# EAGLE design KNOT_v1_0_disp (EAGLE 7.3.0)
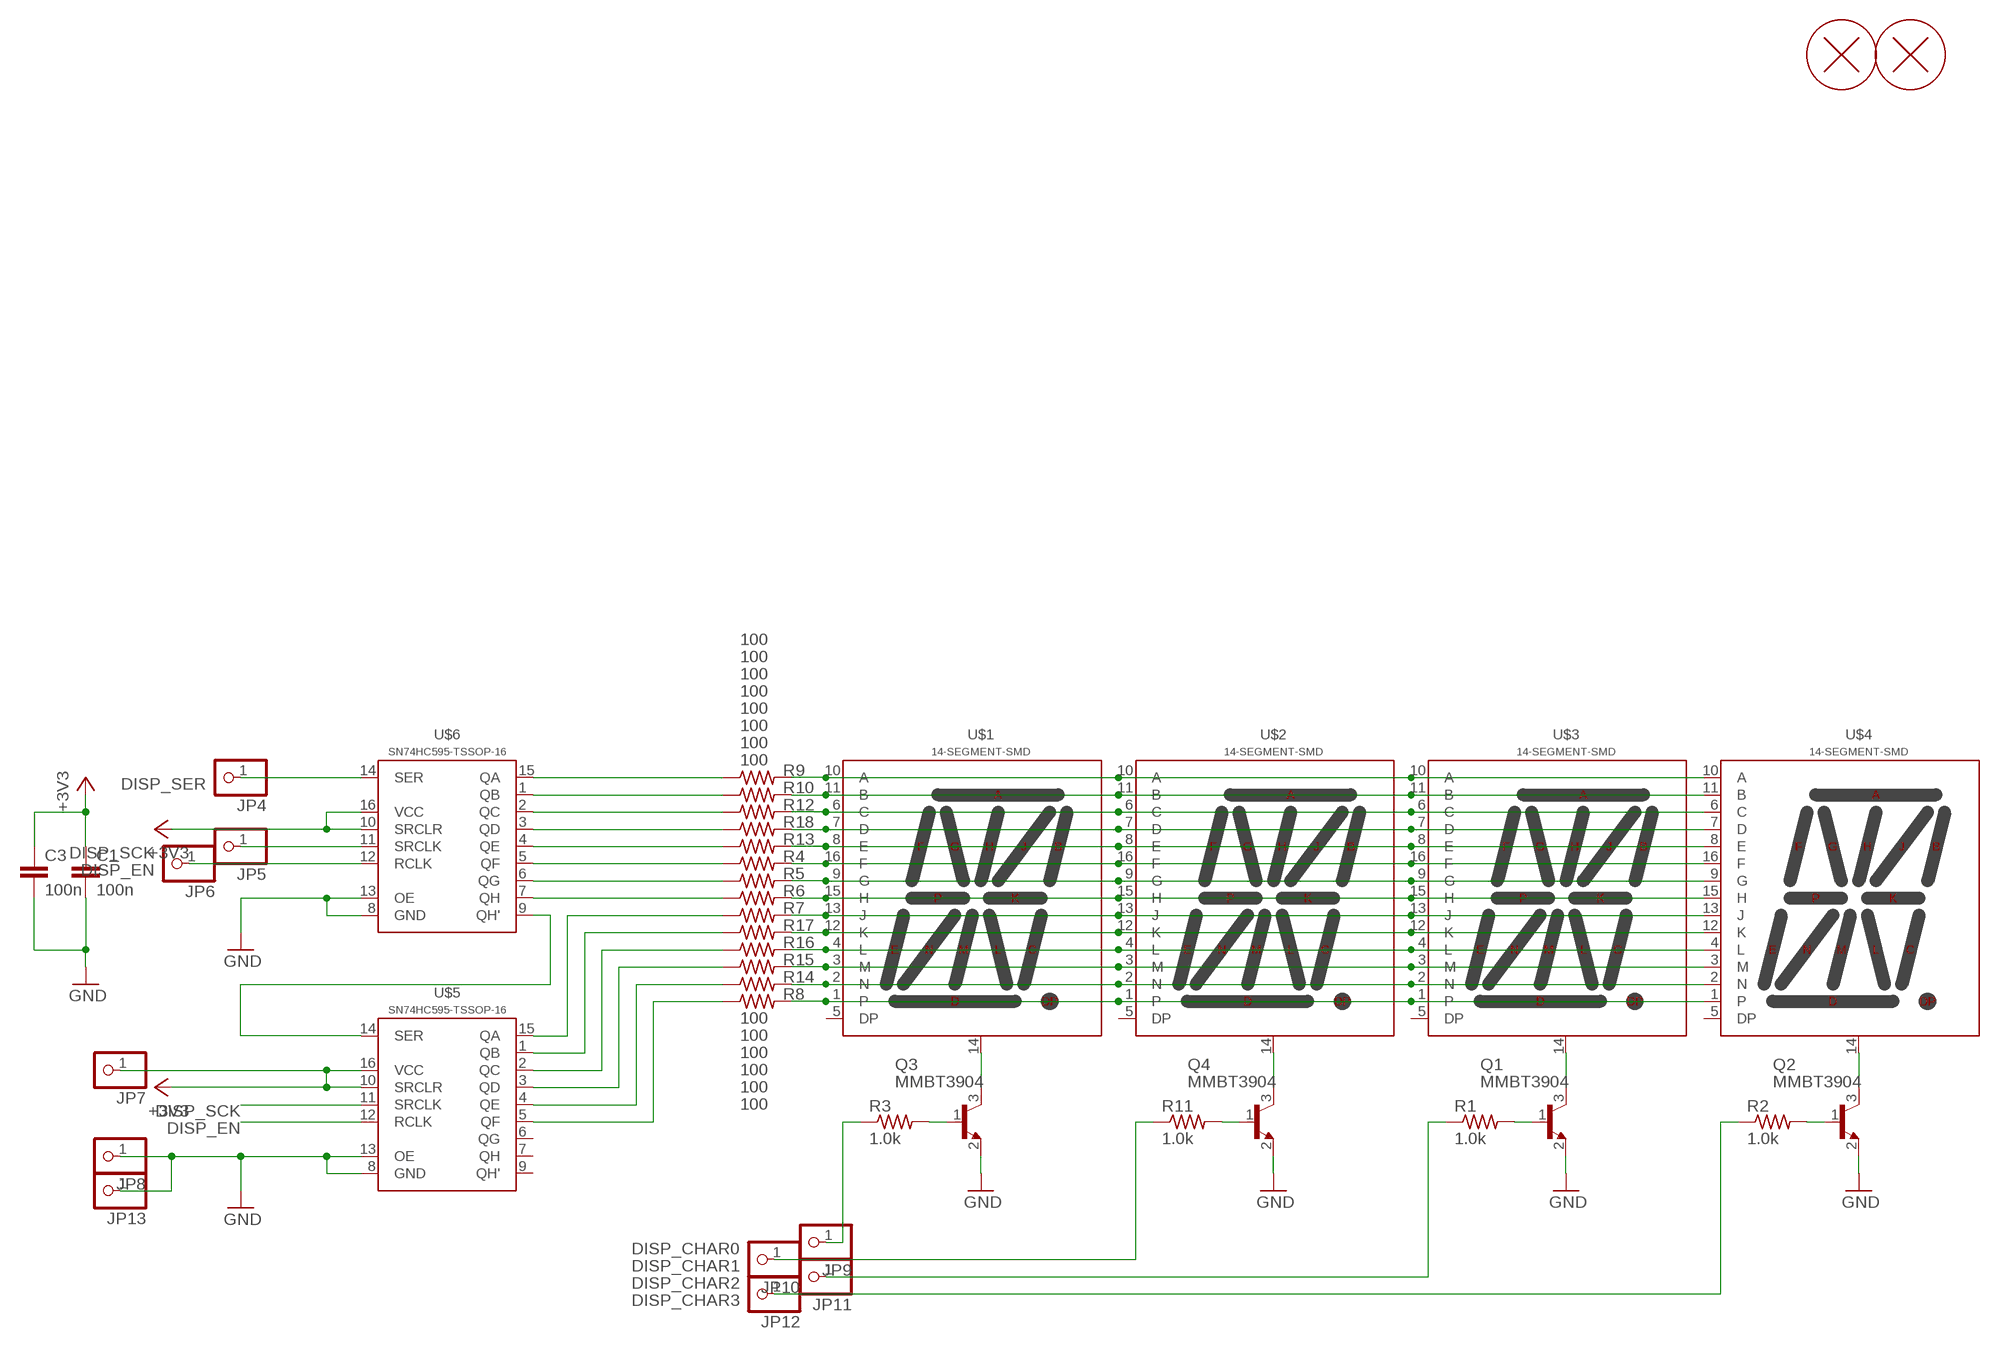
[diagram p0: schematic, sheet 1]

## Parts
C1  100n  CAPACITOR  [RESISTOR_0603]
C3  100n  CAPACITOR  [RESISTOR_0603]
H1  PCB_SCREW  [PCB_SCREW]
H2  PCB_SCREW  [PCB_SCREW]
JP4  PINHD-1X1  [1X01]
JP5  PINHD-1X1  [1X01]
JP6  PINHD-1X1  [1X01]
JP7  PINHD-1X1  [1X01]
JP8  PINHD-1X1  [1X01]
JP9  PINHD-1X1  [1X01]
JP10  PINHD-1X1  [1X01]
JP11  PINHD-1X1  [1X01]
JP12  PINHD-1X1  [1X01]
JP13  PINHD-1X1  [1X01]
Q1  MMBT3904  MMBT3904SOT23  [SOT23]
Q2  MMBT3904  MMBT3904SOT23  [SOT23]
Q3  MMBT3904  MMBT3904SOT23  [SOT23]
Q4  MMBT3904  MMBT3904SOT23  [SOT23]
R1  1.0k  RESISTOR  [RESISTOR_0603]
R2  1.0k  RESISTOR  [RESISTOR_0603]
R3  1.0k  RESISTOR  [RESISTOR_0603]
R4  100  RESISTOR  [RESISTOR_0603]
R5  100  RESISTOR  [RESISTOR_0603]
R6  100  RESISTOR  [RESISTOR_0603]
R7  100  RESISTOR  [RESISTOR_0603]
R8  100  RESISTOR  [RESISTOR_0603]
R9  100  RESISTOR  [RESISTOR_0603]
R10  100  RESISTOR  [RESISTOR_0603]
R11  1.0k  RESISTOR  [RESISTOR_0603]
R12  100  RESISTOR  [RESISTOR_0603]
R13  100  RESISTOR  [RESISTOR_0603]
R14  100  RESISTOR  [RESISTOR_0603]
R15  100  RESISTOR  [RESISTOR_0603]
R16  100  RESISTOR  [RESISTOR_0603]
R17  100  RESISTOR  [RESISTOR_0603]
R18  100  RESISTOR  [RESISTOR_0603]
U$1  14-SEGMENT-SMD  [14-SEGMENT-0.4"-SMD]
U$2  14-SEGMENT-SMD  [14-SEGMENT-0.4"-SMD]
U$3  14-SEGMENT-SMD  [14-SEGMENT-0.4"-SMD]
U$4  14-SEGMENT-SMD  [14-SEGMENT-0.4"-SMD]
U$5  SN74HC595-TSSOP-16  [TSSOP-16]
U$6  SN74HC595-TSSOP-16  [TSSOP-16]

## Nets
+3V3: C1.1 C3.1 JP7.1 U$5.10(SRCLR) U$5.16(VCC) U$6.10(SRCLR) U$6.16(VCC)
DISP_CHAR0: JP9.1 R3.1
DISP_CHAR1: JP10.1 R11.1
DISP_CHAR2: JP11.1 R1.1
DISP_CHAR3: JP12.1 R2.1
DISP_EN: JP6.1 U$5.12(RCLK) U$6.12(RCLK)
DISP_SCK: JP5.1 U$5.11(SRCLK) U$6.11(SRCLK)
DISP_SER: JP4.1 U$6.14(SER)
GND: C1.2 C3.2 JP8.1 JP13.1 Q1.2(E) Q2.2(E) Q3.2(E) Q4.2(E) U$5.8(GND) U$5.13(OE) U$6.8(GND) U$6.13(OE)
N$1: Q3.3(C) U$1.14(CATHODE)
N$2: Q4.3(C) U$2.14(CATHODE)
N$3: Q1.3(C) U$3.14(CATHODE)
N$4: Q2.3(C) U$4.14(CATHODE)
N$5: Q3.1(B) R3.2
N$6: Q4.1(B) R11.2
N$9: Q1.1(B) R1.2
N$10: Q2.1(B) R2.2
N$15: R9.2 U$1.10(A) U$2.10(A) U$3.10(A) U$4.10(A)
N$16: R10.2 U$1.11(B) U$2.11(B) U$3.11(B) U$4.11(B)
N$17: R12.2 U$1.6(C) U$2.6(C) U$3.6(C) U$4.6(C)
N$18: R18.2 U$1.7(D) U$2.7(D) U$3.7(D) U$4.7(D)
N$19: R13.2 U$1.8(E) U$2.8(E) U$3.8(E) U$4.8(E)
N$20: R4.2 U$1.16(F) U$2.16(F) U$3.16(F) U$4.16(F)
N$21: R5.2 U$1.9(G) U$2.9(G) U$3.9(G) U$4.9(G)
N$22: R6.2 U$1.15(H) U$2.15(H) U$3.15(H) U$4.15(H)
N$23: R7.2 U$1.13(J) U$2.13(J) U$3.13(J) U$4.13(J)
N$24: R17.2 U$1.12(K) U$2.12(K) U$3.12(K) U$4.12(K)
N$25: R16.2 U$1.4(L) U$2.4(L) U$3.4(L) U$4.4(L)
N$26: R15.2 U$1.3(M) U$2.3(M) U$3.3(M) U$4.3(M)
N$27: R14.2 U$1.2(N) U$2.2(N) U$3.2(N) U$4.2(N)
N$28: R8.2 U$1.1(P) U$2.1(P) U$3.1(P) U$4.1(P)
N$30: R6.1 U$6.7(QH)
N$31: U$5.14(SER) U$6.9(QH')
N$32: R9.1 U$6.15(QA)
N$33: R10.1 U$6.1(QB)
N$34: R12.1 U$6.2(QC)
N$35: R18.1 U$6.3(QD)
N$36: R13.1 U$6.4(QE)
N$37: R4.1 U$6.5(QF)
N$38: R5.1 U$6.6(QG)
N$39: R7.1 U$5.15(QA)
N$40: R17.1 U$5.1(QB)
N$41: R16.1 U$5.2(QC)
N$42: R15.1 U$5.3(QD)
N$43: R14.1 U$5.4(QE)
N$44: R8.1 U$5.5(QF)
Unconnected: U$1.5(DP) U$2.5(DP) U$3.5(DP) U$4.5(DP) U$5.6(QG) U$5.7(QH) U$5.9(QH')

## Library data of the parts
C1 C3 = parts_aman:CAPACITOR
H1 H2 = parts_aman:PCB_SCREW
JP4-JP13 = parts_aman:PINHD-1X1: PIN HEADER
Q1-Q4 = parts_aman:MMBT3904
R1-R18 = parts_aman:RESISTOR
U$1-U$4 = uBraids_SE:14-SEGMENT
U$5 U$6 = uBraids_SE:SN74HC595

## Board
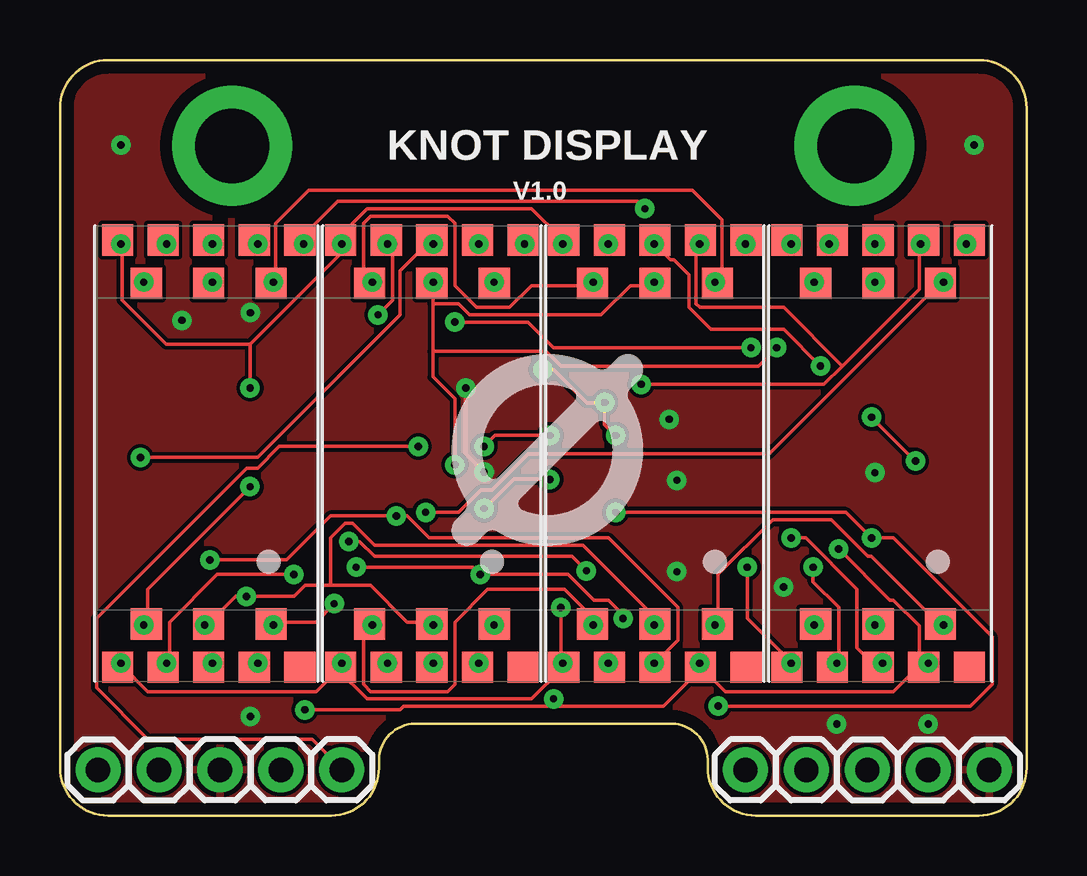
[diagram p1: board, top side]
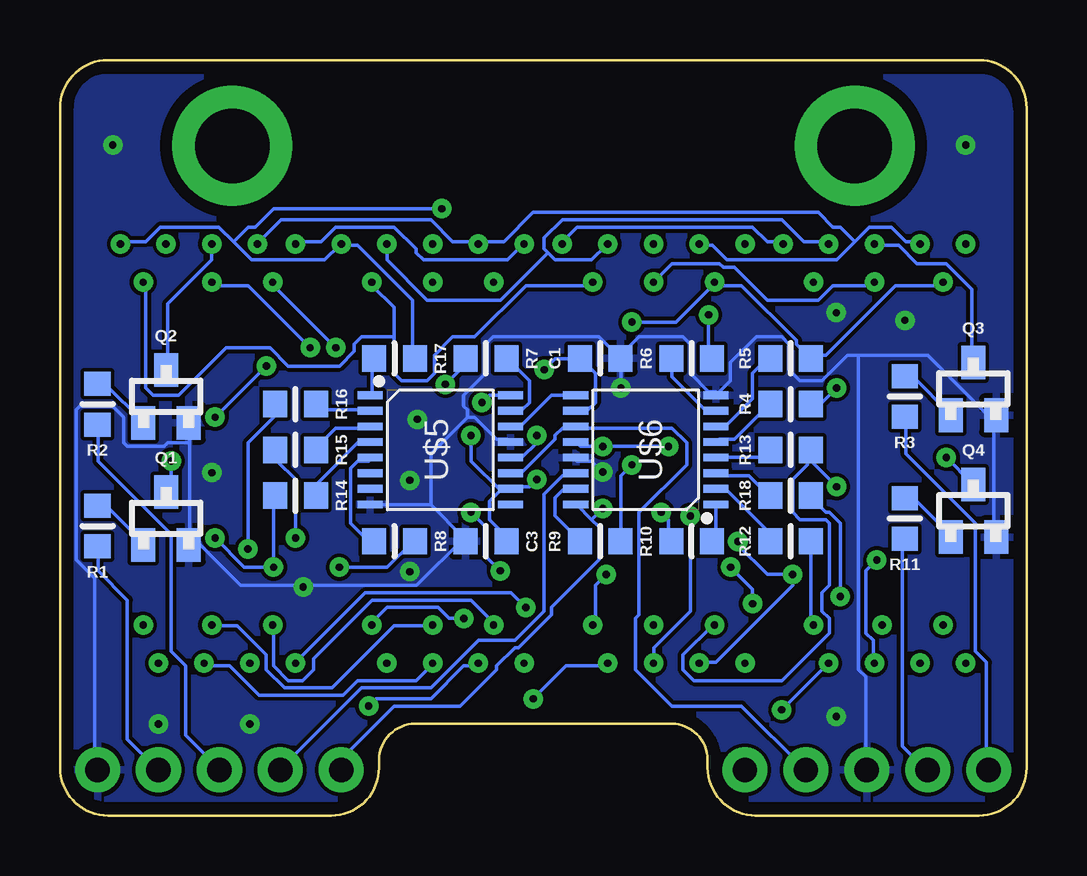
[diagram p2: board, bottom side, seen from below]

Size 40.3 x 31.48 mm. Coordinates in mm from the lower left corner, seen from the top.
Outline: 13.3,2 arc-90 11.3,0 2,0 arc-90 0,2 0,29.48 arc-90 2,31.48 38.3,31.48 arc-90 40.3,29.48 40.3,2 arc-90 38.3,0 29,0 arc-90 27,2
Outline: 13.3,2 13.3,2.33 arc-88 14.8,3.83 25.5,3.83 arc-88 27,2.33 27,2
Outline: 13.3,2 13.3,1.98
Outline: 27,2 27,1.98
Copper layers (1*16): Top 0.035mm / dielectric 1.5mm / Bottom 0.035mm
Design rules "PCBCart-Standard": minimum track width 6mil, minimum drill 12mil, track to track 6mil, track to pad 6mil, pad to pad 6mil, via to via 6mil, smd to smd 6mil, copper to edge 20mil, drill to drill 8mil, minimum pad ring 8mil, minimum via ring 10mil, stop-mask expansion 3mil, vias tented up to drill 25mil, thermal gap 8mil

### Footprints (pad centres in the part's own frame; a part is rotated, then mirrored left to right if it is on the bottom)
RESISTOR_0603 = smd 1 x 1.1: 1 -0.85,0; 2 0.85,0
PCB_SCREW = drill 3.1 pad 5: P$1 0,0
1X01 = drill 1.016 pad 1.88: 1 0,0
SOT23 = smd 1 x 1.4: 1 -0.95,-1.1; 2 0.95,-1.1; 3 0,1.1
14-SEGMENT-0.4"-SMD = smd 1.3 x 1.3: 1 -3.8,-8.9; 2 -1.9,-8.9; 3 0,-8.9; 4 1.9,-8.9; 5 3.8,-8.9; 6 2.6,-7.1; 7 0,-7.1; 8 -2.6,-7.1; 9 -2.6,7.1; 10 0,7.1; 11 2.6,7.1; 12 3.8,8.9; 13 1.9,8.9; 14 0,8.9; 15 -1.9,8.9; 16 -3.8,8.9
TSSOP-16 = smd 0.32 x 1.05: 1 -2.275,-2.925; 2 -1.625,-2.925; 3 -0.975,-2.925; 4 -0.325,-2.925; 5 0.325,-2.925; 6 0.975,-2.925; 7 1.625,-2.925; 8 2.275,-2.925; 9 2.275,2.925; 10 1.625,2.925; 11 0.975,2.925; 12 0.325,2.925; 13 -0.325,2.925; 14 -0.975,2.925; 15 -1.625,2.925; 16 -2.275,2.925

### Placement (x,y rotation side)
C1  17.78,19.05 0 bottom
C3  22.54,11.43 180 bottom
H1  33.12,27.9 0 top
H2  7.17,27.9 0 top
JP4  31.11,1.91 270 top
JP5  9.21,1.91 270 top
JP6  11.75,1.91 270 top
JP7  28.57,1.91 270 top
JP8  6.67,1.91 270 top
JP9  1.59,1.91 90 top
JP10  4.13,1.91 90 top
JP11  36.2,1.91 90 top
JP12  33.66,1.91 90 top
JP13  38.73,1.91 0 top
Q1  35.88,12.38 0 bottom
Q2  35.88,17.46 0 bottom
Q3  2.22,17.78 0 bottom
Q4  2.22,12.7 0 bottom
R1  38.73,12.06 90 bottom
R2  38.73,17.14 90 bottom
R3  5.08,17.46 90 bottom
R4  9.84,17.14 0 bottom
R5  9.84,19.05 0 bottom
R6  13.97,19.05 0 bottom
R7  22.54,19.05 180 bottom
R8  26.35,11.43 0 bottom
R9  17.78,11.43 0 bottom
R10  13.97,11.43 180 bottom
R11  5.08,12.38 90 bottom
R12  9.84,11.43 0 bottom
R13  9.84,15.24 0 bottom
R14  30.48,13.34 180 bottom
R15  30.48,15.24 180 bottom
R16  30.48,17.14 180 bottom
R17  26.35,19.05 0 bottom
R18  9.84,13.34 0 bottom
U$1  6.2,15.09 0 top
U$2  15.5,15.09 0 top
U$3  24.8,15.09 0 top
U$4  34.1,15.09 0 top
U$5  24.45,15.24 270 bottom
U$6  15.88,15.24 90 bottom
U$7  [LOGO_8]  20.32,15.24 0 top

### Tracks (layer width: path | path; a pad name or v marks a point on that pad's centre or on a via)
+3V3  (via drill 0.3)
  Top 0.152: v23.16,15.84 22.71,16.29 v22.71,17.21 21.95,17.21 20.57,18.58 v20.12,18.58 | v20.42,14.01 18.9,14.01 v17.68,12.79
  Bottom 0.152: U$6.10 18.75,16.9 18.29,16.9 17.98,17.21 17.98,18.43 18.59,19.04 C1.1 18.75,19.04 19.66,19.04 v20.12,18.58 | 21.95,13.55 21.64,13.55 U$5.10 | 21.95,13.55 22.4,13.09 22.4,12.33 21.64,11.57 C3.1 | v22.71,17.21 22.4,17.51 21.64,17.51 U$5.16 | v23.16,15.84 23.16,14.77 21.95,13.55 | 21.95,13.55 U$5.10 | 18.14,12.33 17.83,12.03 17.83,10.66 19.81,8.67 19.81,8.37 21.18,7 21.34,7 22.1,6.24 22.1,6.08 23.62,4.56 26.36,4.56 28.5,2.43 28.5,1.97 JP7.1 | 18.14,12.33 18.75,12.94 U$6.16 | v20.42,14.01 20.73,13.7 21.49,13.7 U$5.10 | 18.14,12.33 v17.68,12.79
DISP_CHAR0
  Bottom 0.152: R3.1 5.03,16.6 5.03,15.07 2.13,12.18 2.13,6.85 1.68,6.39 1.68,1.97 JP9.1
DISP_CHAR1
  Bottom 0.152: R11.1 5.18,11.42 5.18,2.88 4.27,1.97 JP10.1
DISP_CHAR2
  Bottom 0.152: R1.1 38.71,11.11 38.71,10.2 37.49,8.98 37.49,3.19 36.27,1.97 JP11.1
DISP_CHAR3
  Bottom 0.152: R2.1 38.71,16.29 38.71,14.77 35.66,11.72 35.66,6.85 35.05,6.24 35.05,3.34 33.68,1.97 JP12.1
DISP_EN  (via drill 0.3)
  Top 0.152: v20.42,15.84 18.14,15.84 v17.68,15.38 | v14.94,15.38 9.14,15.38 8.23,14.47 7.77,14.47 1.52,8.22 1.52,5.32 3.66,3.19 10.52,3.19 11.73,1.97 JP6.1
  Bottom 0.152: v20.42,15.84 20.42,15.53 21.03,14.92 21.49,14.92 U$5.12 | U$6.12 18.75,15.53 18.59,15.38 v17.68,15.38 v14.94,15.38
DISP_SCK
  Bottom 0.152: U$5.11 21.49,14.31 21.03,14.31 19.66,15.68 19.66,15.84 19.36,16.14 18.9,16.14 U$6.11 18.75,16.14 14.78,16.14 14.17,15.53 14.17,14.62 16.15,12.64 16.15,8.37 16.31,8.22 16.31,6.08 14.78,4.56 11.89,4.56 9.3,1.97 JP5.1
DISP_SER
  Bottom 0.152: U$6.14 18.9,14.16 19.36,14.16 20.12,13.4 20.12,8.52 21.34,7.3 22.86,7.3 24.84,5.32 27.74,5.32 31.09,1.97 JP4.1
GND  (via drill 0.3)
  Top 0.152: v17.68,14.31 16.92,15.07 v16.92,17.82
  Bottom 0.152: 34.9,15.53 34.9,16.29 Q2.2 | 34.9,15.53 34.9,11.42 Q1.2 34.9,11.26 34.44,11.26 32.77,9.59 25.43,9.59 23.46,11.56 | 24.84,12.94 27.28,12.94 U$5.8 | 23.47,11.57 23.46,11.56 | 23.47,11.57 24.84,12.94 | 23.47,11.57 C3.2 23.46,11.56 | 23.32,16.6 23.01,16.6 22.1,15.68 21.64,15.68 U$5.13 | 23.32,16.6 24.84,15.07 24.84,12.94 | 34.9,15.53 35.81,15.53 35.97,15.38 37.49,15.38 37.64,15.53 37.64,16.6 38.1,17.06 39.47,17.06 39.62,16.9 39.62,10.66 38.86,9.89 38.86,1.97 JP13.1 | Q4.2 1.37,11.72 1.37,16.6 Q3.2 1.37,16.75 1.68,16.75 4.12,19.19 7.01,19.19 | C1.2 16.92,19.19 16.15,19.95 14.33,19.95 14.02,19.65 14.02,18.43 13.26,17.67 12.95,17.67 U$6.8 12.8,17.67 12.34,18.12 12.34,18.88 11.28,19.95 10.21,19.95 9.91,19.65 9.91,18.58 9.45,18.12 8.53,18.12 7.47,19.19 7.01,19.19 | v17.68,14.31 18.14,14.77 18.75,14.77 U$6.13 | v16.92,17.82 16.92,19.04 C1.2 | 7.01,19.19 7.01,6.08 6.71,5.78 6.71,1.97 JP8.1 | 23.32,16.6 23.32,16.9 23.47,17.06 23.47,17.51 22.55,18.43 22.55,19.65 22.25,19.95 17.83,19.95 17.07,19.19 C1.2
  other vias: 2.54,27.94 38.1,27.94 25.4,16.51 25.72,13.97 30.16,9.53 33.97,14.29 5.08,20.64 7.94,4.13 32.38,3.81 36.2,3.81 25.72,10.16 7.94,20.95
  pour Bottom: -0.32,-0.32 40.34,-0.32 arc90 40.64,-0.01 40.64,31.43 40.64,31.75 -0.01,31.75 arc90 -0.32,31.45
  pour Top: 0,-0.32 40.34,-0.32 arc90 40.64,-0.01 40.64,31.75 -0.01,31.75 arc90 -0.32,31.45 -0.32,-0.32
N$1  (via drill 0.3)
  Top 0.152: U$1.14 6.2,23.96 v6.35,23.81
  Bottom 0.152: v6.35,23.81 6.25,23.76 5.33,23.76 4.57,23 3.35,23 2.29,21.93 2.29,18.88 Q3.3
N$2  (via drill 0.3)
  Top 0.152: v15.56,23.81 15.38,23.99 U$2.14 15.39,23.91 14.17,22.69 14.17,20.87 8.23,14.92 v3.35,14.92
  Bottom 0.152: v3.35,14.92 2.29,13.86 Q4.3
N$3  (via drill 0.3)
  Top 0.152: v24.77,23.81 24.91,23.67 U$3.14 24.84,23.76 25.45,23.15 25.6,23.15 26.21,22.54 26.21,21.17 27.13,20.26 30.18,20.26 v31.7,18.73 | v35.66,14.77 v33.83,16.6
  Bottom 0.152: v33.83,16.6 v31.7,18.73 | v35.66,14.77 35.66,13.7 35.81,13.55 Q1.3
N$4  (via drill 0.3)
  Top 0.152: U$4.14 34.1,23.94 v33.97,23.81
  Bottom 0.152: v33.97,23.81 33.98,23.76 33.98,23.15 35.81,21.32 35.81,18.58 Q2.3
N$5
  Bottom 0.152: R3.2 5.03,18.28 4.72,18.28 3.2,16.75 Q3.1
N$6
  Bottom 0.152: R11.2 5.03,13.09 4.57,13.09 3.2,11.72 Q4.1
N$9
  Bottom 0.152: R1.2 38.71,12.79 38.25,12.79 36.88,11.42 Q1.1
N$10
  Bottom 0.152: R2.2 38.71,17.97 38.41,17.97 36.88,16.45 Q2.1
N$15  (via drill 0.3)
  Top 0.152: v15.56,22.23 15.5,21.96 U$2.10 15.54,21.93 15.54,21.32 | U$1.10 6.2,22.05 v6.35,22.23 | v24.77,22.23 U$3.10 24.69,22.09 23.77,22.09 22.55,20.87 17.07,20.87 16.61,21.32 15.54,21.32 | U$4.10 34.1,22.04 v33.97,22.23 | v16.46,14.62 16.46,17.36 15.54,18.28 15.54,19.34 | 15.54,21.32 15.54,19.34 | v29.87,19.49 29.11,18.73 20.88,18.73 20.27,19.34 15.54,19.34
  Bottom 0.152: v16.46,14.62 16.92,14.16 16.92,11.57 R9.2 | v15.56,22.23 14.78,23 12.8,23 12.65,22.85 12.19,22.85 10.82,21.48 8.69,21.48 8.08,22.09 6.4,22.09 v6.35,22.23 | v29.87,19.49 32.46,22.09 33.83,22.09 v33.97,22.23
N$16  (via drill 0.3)
  Top 0.152: v8.89,22.23 8.8,22.14 U$1.11 8.99,22.24 8.99,24.68 10.36,26.05 26.36,26.05 27.58,24.83 27.58,22.54 U$3.11 | U$3.11 27.4,22.13 v27.3,22.23 | v36.83,22.23 36.7,22.42 U$4.11 36.58,22.09 29.57,15.07 19.51,15.07 17.98,13.55 17.53,13.55 16.61,12.64 v15.24,12.64 | U$3.11 27.4,22.32 27.62,22.54 | U$2.11 18.1,21.91 v18.1,22.23
  Bottom 0.152: 26.36,19.95 26.36,21.17 27.28,22.09 v27.3,22.23 | 26.36,19.95 26.36,18.43 26.06,18.12 24.99,18.12 24.69,18.43 24.69,19.19 23.93,19.95 23.01,19.95 20.88,22.09 18.14,22.09 v18.1,22.23 | v15.24,12.64 14.94,12.33 14.94,11.57 R10.2 | 26.36,19.95 27.74,19.95 28.04,19.65 28.04,19.34 28.65,18.73 30.79,18.73 31.55,19.49 33.38,19.49 35.36,17.51 36.42,17.51 36.73,17.82 36.73,22.09 v36.83,22.23
N$17  (via drill 0.3)
  Top 0.152: v8.89,7.94 8.62,7.99 U$1.6 8.99,8.06 10.67,8.06 v11.43,8.83 | U$2.6 18.1,8.25 v18.1,7.94 | v36.83,7.94 36.7,7.81 U$4.6 36.58,8.06 33.83,10.81 33.68,10.81 32.16,12.33 29.72,12.33 27.43,10.05 27.43,8.06 U$3.6 27.09,7.72 v27.3,7.94 | v23.47,8.22 23.47,8.37 22.86,8.98 22.25,8.98 21.18,10.05 v17.53,10.05 17.22,10.35 v12.34,10.35
  Bottom 0.152: R12.2 8.99,11.42 8.99,8.06 v8.89,7.94 | v17.53,10.05 17.98,9.59 17.98,8.06 v18.1,7.94 | v23.47,8.22 24.08,8.22 24.54,8.67 26.67,8.67 27.28,8.06 v27.3,7.94 | v11.43,8.83 11.43,9.44 v12.34,10.35
N$18  (via drill 0.3)
  Top 0.152: v6.03,7.94 6.2,8.11 U$1.7 6.25,8.06 7.32,9.13 v7.77,9.13 9.75,9.13 10.21,9.59 11.28,9.59 | v15.56,7.94 15.5,8.2 U$2.7 15.39,8.06 14.48,8.06 12.95,9.59 11.28,9.59 | U$4.7 34.1,8.12 v33.97,7.94 | v24.77,7.94 24.8,8.22 U$3.7 24.84,8.22 21.79,11.26 13.11,11.26 12.19,12.18 11.89,12.18 11.28,11.57 11.28,9.59
  Bottom 0.152: v24.77,7.94 24.84,7.91 26.36,7.91 28.96,5.32 30.94,5.32 31.7,6.08 31.7,6.69 32.92,7.91 33.83,7.91 v33.97,7.94 | v7.77,9.13 7.77,12.18 8.23,12.64 8.38,12.64 8.99,13.25 R18.2
N$19  (via drill 0.3)
  Top 0.152: v3.49,7.94 3.29,7.73 U$1.8 3.66,8.06 3.66,9.44 v7.92,13.7 | v13.02,7.94 12.97,7.99 U$2.8 12.8,7.91 12.65,7.76 12.65,5.47 12.95,5.17 16.15,5.17 16.46,5.47 16.46,8.06 17.83,9.44 21.03,9.44 22.1,8.37 22.1,8.06 U$3.8 22.27,7.99 v22.23,7.94 | U$4.8 31.5,8.18 v31.43,7.94
  Bottom 0.152: v22.23,7.94 22.25,8.06 23.16,8.98 27.28,8.98 29.72,6.54 29.72,6.08 30.18,5.63 30.79,5.63 31.39,6.24 31.39,7.91 v31.43,7.94 | 9.14,14.92 9.14,14.62 9.75,14.01 9.75,12.64 9.45,12.33 8.38,12.33 8.23,12.18 8.23,9.59 8.53,9.28 8.53,8.52 8.23,8.22 8.23,7.61 10.21,5.63 13.87,5.63 14.33,6.08 14.33,6.69 13.11,7.91 v13.02,7.94 | 9.14,14.92 9.14,15.23 R13.2 9.14,14.92 | 9.14,14.92 v7.92,13.7
N$20  (via drill 0.3)
  Top 0.152: v2.54,23.81 2.71,23.99 U$1.16 2.59,23.76 2.59,21.48 4.42,19.65 7.92,19.65 | U$2.16 11.7,23.86 v11.75,23.81 | U$2.16 11.92,23.99 12.06,24.13 | v20.95,23.81 21.1,23.99 U$3.16 20.88,24.07 19.66,25.29 12.8,25.29 12.04,24.52 12.04,24.07 U$2.16 | U$4.16 30.34,23.67 v30.48,23.81 | 7.92,19.65 v7.92,17.82 | 7.92,19.65 11.73,23.46 11.73,23.76 U$2.16
  Bottom 0.152: v7.92,17.82 8.53,17.21 8.99,17.21 R4.2 | v30.48,23.81 30.48,23.91 29.41,23.91 28.8,24.52 26.36,24.52 25.45,23.61 25.45,23.46 25.15,23.15 21.64,23.15 21.03,23.76 v20.95,23.81
N$21  (via drill 0.3)
  Top 0.152: U$1.9 3.6,22.43 v3.49,22.23 | U$2.9 12.9,22.02 13.02,21.91 | v22.23,22.23 22.2,21.93 U$3.9 22.1,22.09 19.66,22.09 18.75,21.17 17.37,21.17 16.46,22.09 16.46,24.68 16.15,24.98 12.95,24.98 12.65,24.68 12.65,22.39 12.8,22.24 U$2.9 | U$2.9 12.98,22.19 v13.02,22.23 | U$4.9 31.39,22.19 v31.43,22.23 | v28.8,19.49 20.57,19.49 19.51,20.56 v16.46,20.56
  Bottom 0.152: v3.49,22.23 3.5,22.09 5.49,22.09 8.38,19.19 8.99,19.19 R5.2 9.14,19.19 9.6,19.65 9.6,19.8 11.89,22.09 12.95,22.09 v13.02,22.23 13.11,22.09 14.63,20.56 v16.46,20.56 | v28.8,19.49 31.39,22.09 v31.43,22.23
N$22  (via drill 0.3)
  Top 0.152: v13.65,23.81 13.6,24.08 U$2.15 13.72,23.76 13.87,23.61 13.87,21.48 v13.26,20.87 | U$4.15 32.2,23.63 v32.07,23.81 | U$3.15 22.69,23.99 v22.86,23.81 | U$1.15 4.3,23.95 v4.45,23.81 U$1.15
  Bottom 0.152: 22.86,23.91 23.93,23.91 24.84,24.83 31.09,24.83 32,23.91 v32.07,23.81 | v13.26,20.87 13.26,19.19 R6.2 | 7.16,23.91 7.92,23.15 12.5,23.15 13.11,23.76 13.56,23.76 v13.65,23.81 | 7.16,23.91 6.55,24.52 5.64,24.52 5.03,23.91 4.57,23.91 v4.45,23.81 | 22.86,23.91 21.79,23.91 20.57,25.13 8.69,25.13 8.08,24.52 7.77,24.52 7.16,23.91 | 22.86,23.91 v22.86,23.81
N$23  (via drill 0.3)
  Top 0.152: U$1.13 8.1,23.96 v8.26,23.81 | v26.67,23.81 26.81,23.99 U$3.13 26.67,23.76 26.52,23.61 26.52,21.32 26.67,21.17 30.18,21.17 32.61,18.73 | v35.88,23.81 36.05,23.99 U$4.13 35.81,23.76 35.81,21.93 32.61,18.73 | U$2.13 17.4,24.07 v17.46,23.81 | v24.23,17.97 31.85,17.97 32.61,18.73
  Bottom 0.152: v24.23,17.97 23.47,18.73 23.47,19.04 R7.2 | 19.96,23.46 19.66,23.15 18.14,23.15 17.53,23.76 v17.46,23.81 | 19.96,23.46 20.12,23.61 20.12,24.07 19.36,24.83 10.21,24.83 9.3,23.91 8.38,23.91 v8.26,23.81 | v26.67,23.81 26.67,23.15 24.99,21.48 21.95,21.48 19.96,23.46
N$24  (via drill 0.3)
  Top 0.152: v10.16,23.81 10.02,23.99 U$1.12 10.06,24.07 11.58,25.59 24.08,25.59 v24.38,25.29 | U$2.12 19.3,23.88 v19.37,23.81 | U$4.12 37.96,23.99 v37.78,23.81 | U$3.12 28.6,23.84 v28.57,23.81
  Bottom 0.152: v10.16,23.81 10.21,23.91 10.82,23.91 11.43,24.52 18.75,24.52 19.36,23.91 v19.37,23.81 | R17.2 25.6,19.19 25.6,21.48 27.89,23.76 28.5,23.76 v28.57,23.81 28.65,23.76 29.26,23.15 32.31,23.15 33.07,23.91 | 33.07,23.91 33.68,24.52 36.12,24.52 36.73,23.91 37.64,23.91 v37.78,23.81 | v24.38,25.29 31.39,25.29 32.16,24.52 32.46,24.52 33.07,23.91
N$25  (via drill 0.3)
  Top 0.152: U$1.4 7.79,6.2 v8.26,6.35 | U$2.4 17.4,6.29 v17.46,6.35 | U$4.4 36.03,6.19 v36.2,6.35 | U$3.4 26.7,6.32 v26.67,6.35 | v32.46,11.11 34.59,8.98 34.75,8.98 35.81,7.91 35.81,6.69 36.12,6.39 U$4.4 | v10.21,4.41 14.17,4.41 14.33,4.56 20.57,4.56 | 20.57,4.56 25.15,4.56 26.67,6.08 U$3.4 | 20.57,4.56 v20.57,4.86 | U$4.4 35.97,6.08 35.66,6.08 34.75,5.17 27.74,5.17 26.82,6.08 U$3.4
  Bottom 0.152: v32.46,11.11 32.46,15.53 31.39,16.6 31.39,17.06 R16.2 | v10.21,4.41 8.38,6.24 v8.26,6.35 | v20.57,4.86 19.2,6.24 17.53,6.24 v17.46,6.35
N$26  (via drill 0.3)
  Top 0.152: U$1.3 6.2,6.2 v6.35,6.35 | U$2.3 15.5,6.3 v15.56,6.35 | v34.29,6.35 34.13,6.19 U$4.3 33.98,6.24 33.22,7 33.22,9.44 31.09,11.57 v30.48,11.57 | v24.77,6.35 24.8,6.31 U$3.3 24.84,6.39 25.76,7.3 25.76,8.67 22.86,11.57 15.39,11.57 14.48,12.48 v14.02,12.48 11.28,12.48 9.45,10.66 v6.25,10.66
  Bottom 0.152: v30.48,11.57 30.48,14.01 31.24,14.77 31.24,15.23 R15.2 | v6.25,10.66 6.71,10.2 6.71,7.61 6.4,7.3 6.4,6.39 v6.35,6.35 | v14.02,12.48 14.02,8.52 15.54,7 15.54,6.39 v15.56,6.35 | v34.29,6.35 34.29,6.24 33.22,6.24 32,5.02 28.5,5.02 27.89,5.63 25.45,5.63 24.84,6.24 v24.77,6.35
N$27  (via drill 0.3)
  Top 0.152: v4.45,6.35 4.3,6.21 U$1.2 4.57,6.39 4.57,8.06 6.55,10.05 v9.75,10.05 | U$2.2 13.6,6.3 v13.65,6.35 | v32.38,6.35 32.22,6.19 U$4.2 32.46,6.39 32.46,8.67 31.39,9.74 v31.39,10.35 | U$3.2 23.02,6.19 v22.86,6.35 | v27.43,4.56 37.95,4.56 38.86,5.47 38.86,7.45 34.75,11.57 v33.83,11.57 32.77,12.64 v23.16,12.64 | v12.04,11.42 12.5,11.42 13.11,10.81 21.34,10.81 v21.95,10.2
  Bottom 0.152: v13.65,6.35 13.56,6.39 12.95,6.39 9.75,9.59 v9.75,10.05 10.82,10.05 12.04,11.26 v12.04,11.42 | R14.2 31.39,13.25 v31.39,10.35 32.61,10.35 v33.83,11.57 | v27.43,4.56 27.13,4.86 24.84,4.86 23.47,6.24 22.86,6.24 v22.86,6.35 | v21.95,10.2 22.55,10.81 22.55,12.03 v23.16,12.64
N$28  (via drill 0.3)
  Top 0.152: v2.54,6.35 2.4,6.21 U$1.1 2.59,6.24 3.66,5.17 10.67,5.17 11.58,6.08 | v11.75,6.35 11.7,6.31 U$2.1 11.58,6.08 | U$3.1 21,6.08 v20.95,6.35 | v30.48,6.35 30.32,6.19 U$4.1 30.48,6.39 28.65,8.22 v28.65,10.35 | 11.58,6.08 12.8,4.86 19.66,4.86 20.88,6.08 U$3.1 | v20.88,8.67 20.88,6.39 U$3.1
  Bottom 0.152: v28.65,10.35 26.66,10.35 25.59,11.42 R8.2 | v20.88,8.67 21.49,9.28 27.58,9.28 30.48,6.39 v30.48,6.35
N$30
  Bottom 0.152: U$6.7 12.95,16.9 13.41,16.9 14.78,18.28 14.78,19.04 R6.1
N$31
  Bottom 0.152: U$6.9 18.9,17.51 19.81,17.51 21.03,16.29 21.49,16.29 U$5.14
N$32
  Bottom 0.152: U$6.15 18.9,13.55 19.36,13.55 19.66,13.25 19.66,12.48 18.75,11.57 R9.1
N$33
  Bottom 0.152: U$6.1 12.95,12.94 12.95,11.72 13.11,11.57 R10.1
N$34
  Bottom 0.152: U$6.2 12.8,13.55 12.5,13.55 10.82,11.87 10.82,11.57 R12.1
N$35
  Bottom 0.152: U$6.3 12.8,14.16 11.58,14.16 10.82,13.4 R18.1
N$36
  Bottom 0.152: U$6.4 12.8,14.92 11.12,14.92 10.82,15.23 R13.1
N$37
  Bottom 0.152: U$6.5 12.8,15.68 12.19,15.68 10.82,17.06 R4.1
N$38
  Bottom 0.152: U$6.6 12.8,16.29 12.5,16.29 11.43,17.36 11.43,18.43 10.82,19.04 R5.1
N$39
  Bottom 0.152: U$5.15 21.49,16.9 21.03,16.9 20.73,17.21 20.73,18.12 21.64,19.04 R7.1
N$40
  Bottom 0.152: U$5.1 27.28,17.67 27.28,19.04 R17.1
N$41
  Bottom 0.152: U$5.2 27.43,16.9 29.41,16.9 29.57,17.06 R16.1
N$42
  Bottom 0.152: U$5.3 27.43,16.14 28.8,16.14 29.57,15.38 R15.1
N$43
  Bottom 0.152: U$5.4 27.43,15.53 27.89,15.53 29.57,13.86 29.57,13.4 R14.1
N$44
  Bottom 0.152: U$5.5 27.43,14.77 27.89,14.77 28.19,14.47 28.19,12.18 27.58,11.57 R8.1

### Text on the board
tPlace: KNOT DISPLAY | V1.0